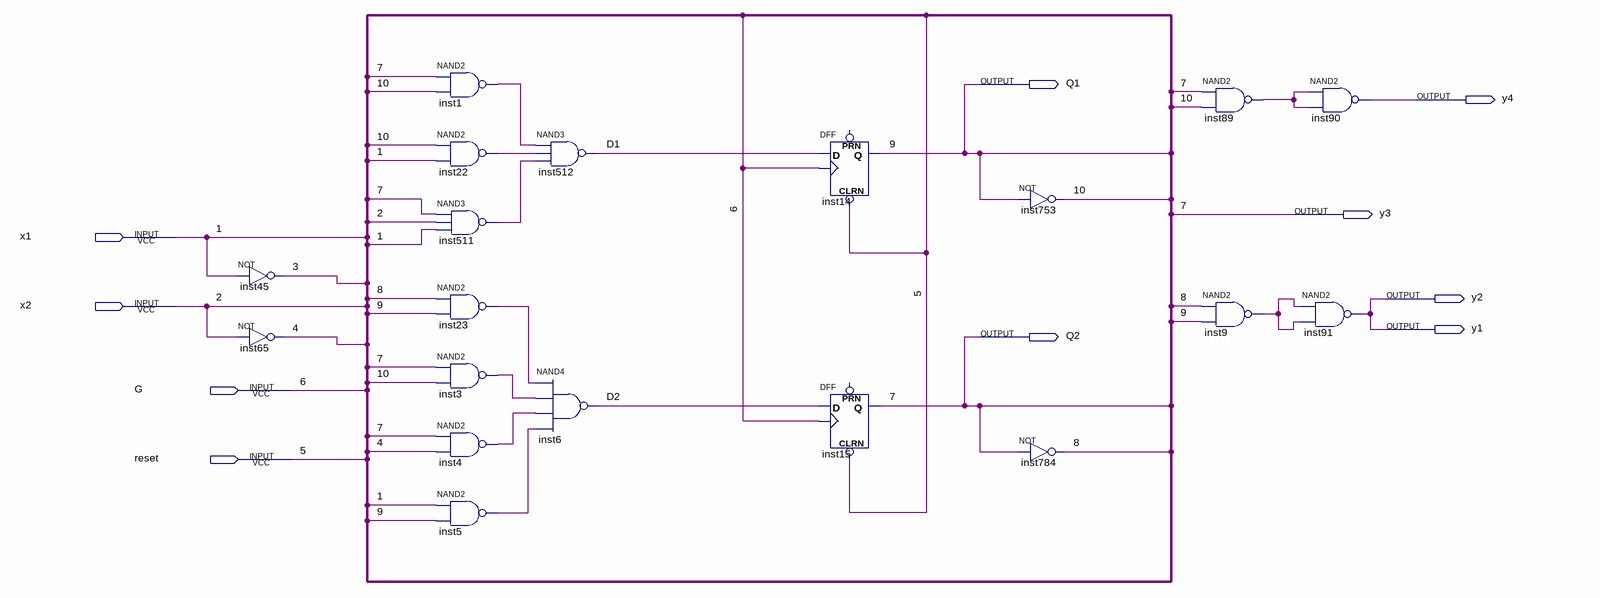
[diagram p0: schematic sheet]
// Quartus schematic DMKR_2.bdf as structural Verilog: 19 symbols, 10 pins
module DMKR_2 (
  input  x1,
  input  x2,
  input  G,
  input  reset,
  output Q1,
  output y4,
  output y3,
  output y2,
  output y1,
  output Q2
);

  wire \3 , \4 , \8 , \10 , D1, D2, inst1_out, inst3_out, inst4_out, inst5_out, inst9_out, inst22_out,
       inst23_out, inst89_out, inst511_out;

  not inst45 (\3 , x1);
  not inst65 (\4 , x2);
  nand inst1 (inst1_out, Q2, \10 );
  nand inst22 (inst22_out, \10 , x1);
  nand inst511 (inst511_out, Q2, x2, x1);
  nand inst23 (inst23_out, \8 , Q1);
  nand inst3 (inst3_out, Q2, \10 );
  nand inst4 (inst4_out, Q2, \4 );
  nand inst5 (inst5_out, x1, Q1);
  nand inst512 (D1, inst1_out, inst22_out, inst511_out);
  nand inst6 (D2, inst23_out, inst3_out, inst4_out, inst5_out);
  DFF inst14 (.CLRN(reset), .CLK(G), .D(D1), .Q(Q1));  // open: PRN
  DFF inst15 (.CLRN(reset), .CLK(G), .D(D2), .Q(Q2));  // open: PRN
  not inst753 (\10 , Q1);
  not inst784 (\8 , Q2);
  nand inst89 (inst89_out, Q2, \10 );
  nand inst9 (inst9_out, \8 , Q1);
  nand inst90 (y4, inst89_out, inst89_out);
  nand inst91 (y1, inst9_out, inst9_out);

  assign y2 = y1;
  assign y3 = Q2;

  // Other names for the same wires on the sheet: 5 = reset; 6 = G; 9 = Q1; 7 = Q2; 1 = x1; 2 = x2
endmodule
